# Altium schematic sheet Audio.SchDoc: Аналоговая часть
size 420 x 297 mm; Author: DarkFox; CompanyName: Open Source; DocumentNumber: 3; SheetNumber: 3; SheetTotal: 3; PageSetup: Record=PageOptions|CenterHorizontal=True|CenterVertical=True|PrintScale=0.94|XCorrection=1.00|YCorrection=1.00|PrintKind=1|BorderSize=5000000|LeftOffset=0|BottomOffset=0|Orientation=1|PaperLength=1000|PaperWidth=1000|Scale=100|PaperSource=7|PrintQuality=-4|MediaType=1|DitherType=10|PaperKind=A4|PrintScaleMode=1; DecimalNumber: 2083.234267.004; Name: Аналоговая часть; DocumentName: Sheet1.SCHDOC
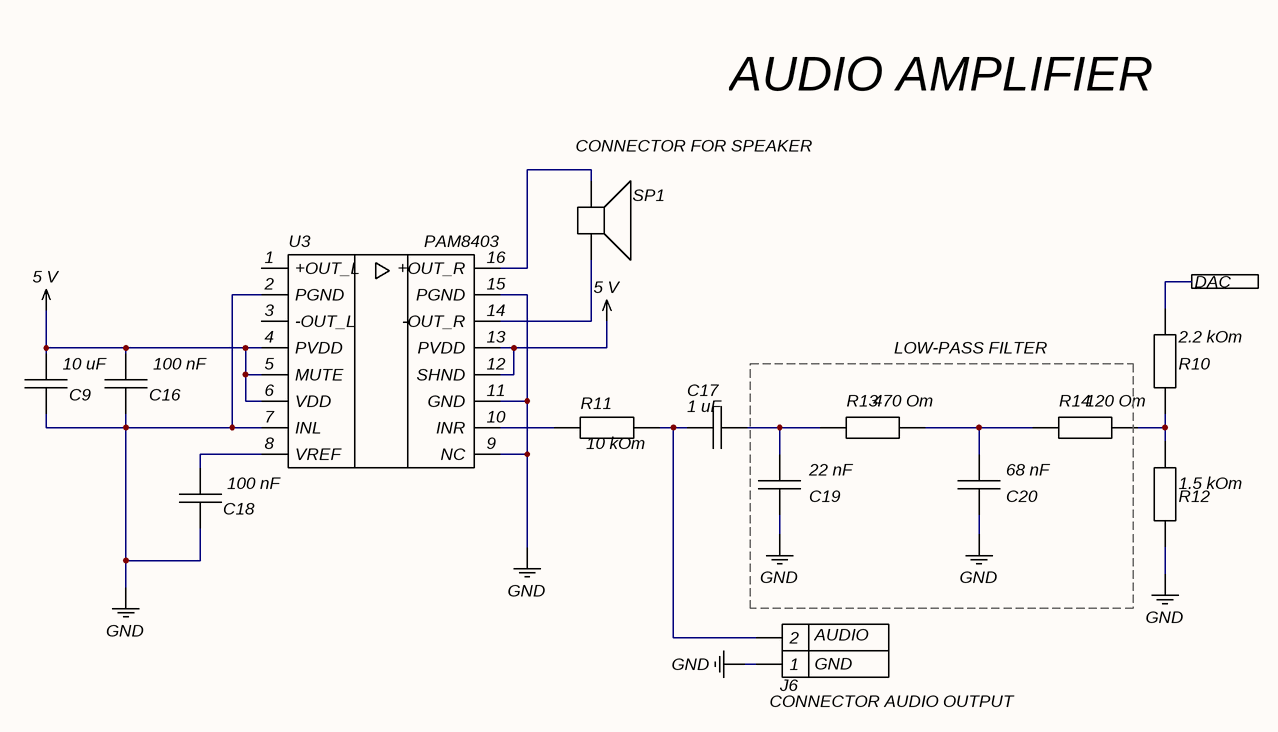
[diagram p0: Audio.SchDoc]

## Parts
C9  10 uF  [0805]
C16  100 nF  [0805]
C17  1 uF  [0805]
C18  100 nF  [0805]
C19  22 nF  [0805]
C20  68 nF  [0805]
J6  2x2.54  [SMD 2x2.54]  (value not drawn)
R10  2.2 kOm  [1206]
R11  10 kOm  [0805]
R12  1.5 kOm  [1206]
R13  470 Om  [1206]
R14  120 Om  [1206]
SP1  speaker  [SMD 2x2.54]  (value not drawn)
U3  PAM8403  [sop16]

## Blocks framed on the sheet
LOW-PASS FILTER: C19 C20 R13 R14

## Ports
DAC

## Nets
5 V: C9.2 C16.2 U3.4(PVDD) U3.5(MUTE) U3.6(VDD) U3.12(SHND) U3.13(PVDD)
GND: C9.1 C16.1 C18.1 C19.1 C20.1 J6.1 R12.1 U3.2(PGND) U3.7(INL) U3.9(NC) U3.11(GND) U3.15(PGND)
DAC: R10.2 ; port DAC
NetC17_1: C17.1 J6.2 R11.2
NetC17_2: C17.2 C19.2 R13.1
NetC18_2: C18.2 U3.8(VREF)
NetC20_2: C20.2 R13.2 R14.1
NetR10_1: R10.1 R12.2 R14.2
NetR11_1: R11.1 U3.10(INR)
NetSP1_1: SP1.1 U3.14(-OUT_R)
NetSP1_2: SP1.2 U3.16(+OUT_R)

Not connected (* = marked no-connect by the designer): U3 1(+OUT_L_) 3(-OUT_L)

## Notes on the sheet
- AUDIO AMPLIFIER
- (near SP1) CONNECTOR FOR SPEAKER
- (near J6) AUDIO
- (near J6) CONNECTOR AUDIO OUTPUT
- (near J6) GND
- Перв.примен.
- Справ.№
- Подп. и дата
- Инв.№ дубл.
- Взам.инв.№
- Подп.и дата
- Разраб.
- Изм.
- Лист
- № докум.
- Подп.
- Дата
- Лит.
- Масштаб
- Масса
- Т.контр.
- Пров.
- СХЕМА   ЭЛЕКТРИЧЕСКАЯ
- ПРИНЦИПИАЛЬНАЯ
- Листов
- Инв.№ подл.
- Утв.
- Н.контр.
- Нач.сект.

## Library data of the parts
C9 C16-C20 = Cup
R10-R14 = Res